# EAGLE design octanis_eps_v05 (EAGLE 7.2.0)
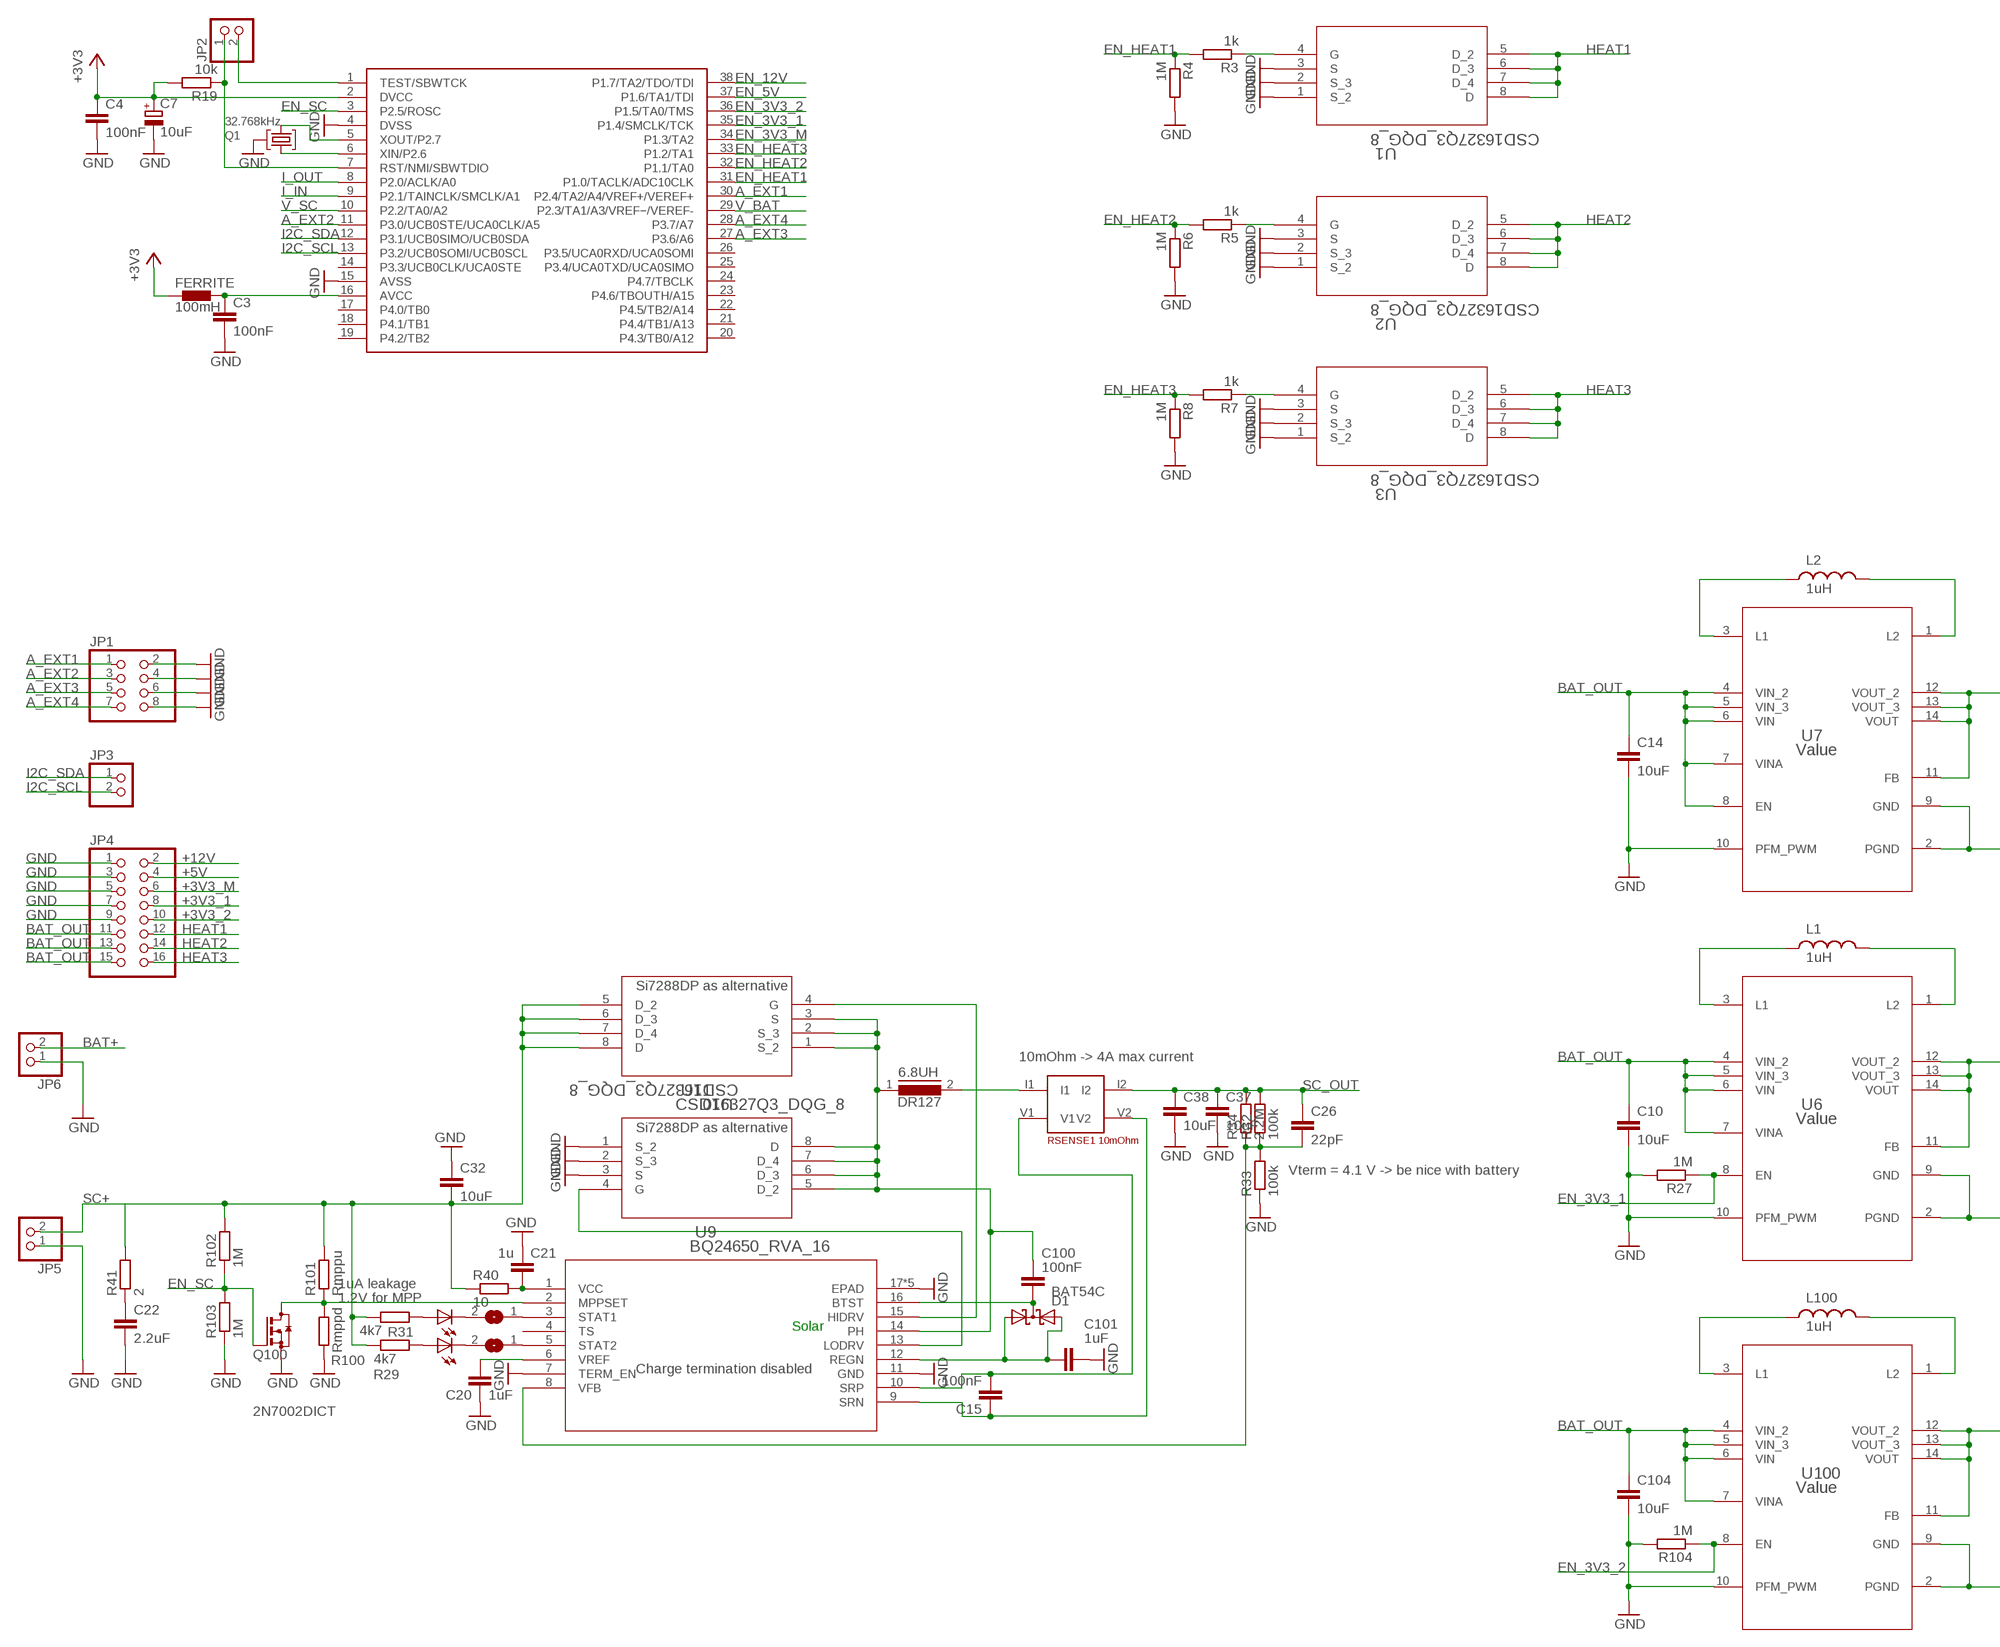
[diagram p0: schematic, sheet 1, part 1 of 2]
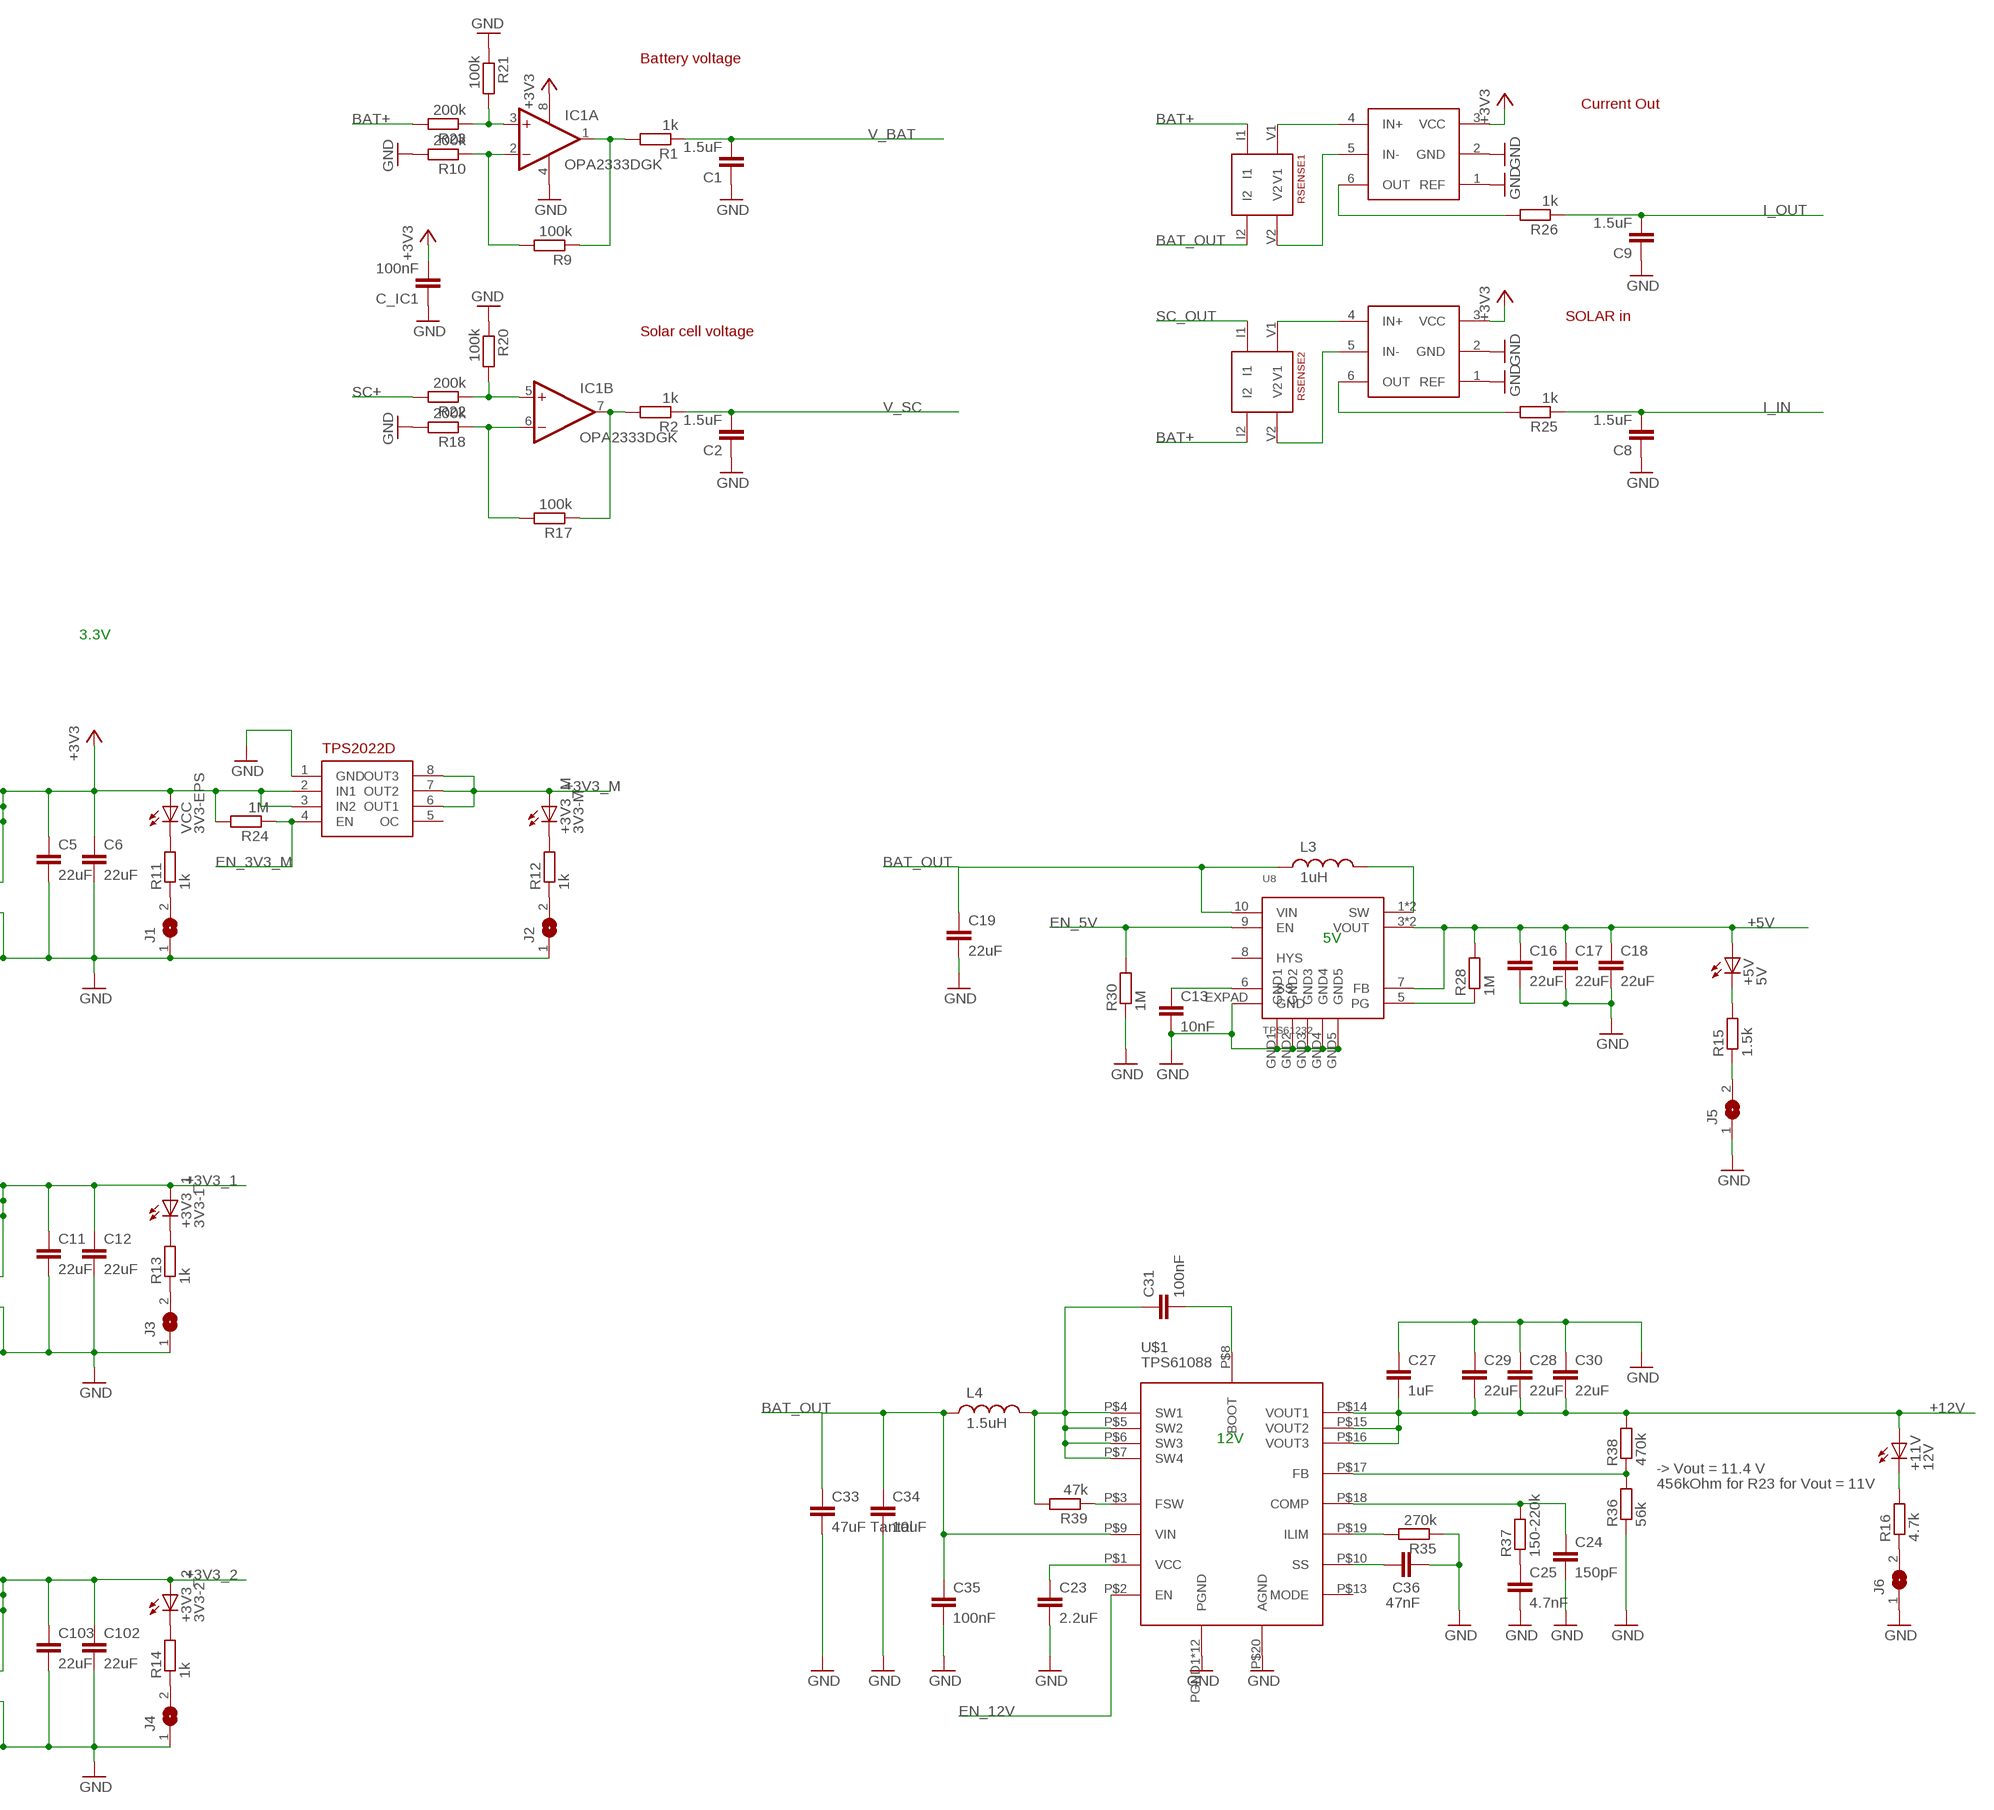
[diagram p1: schematic, sheet 1, part 2 of 2]

## Parts
6.8UH  DR127  [DR127]
+3V3_1  3V3-1  LEDCHIPLED_0603  [CHIPLED_0603]
+3V3_2  3V3-2  LEDCHIPLED_0603  [CHIPLED_0603]
+3V3_M  3V3-M  LEDCHIPLED_0603  [CHIPLED_0603]
+5V  5V  LEDCHIPLED_0603  [CHIPLED_0603]
+11V  12V  LEDCHIPLED_0603  [CHIPLED_0603]
C1  1.5uF  C-EUC0603  [C0603]
C2  1.5uF  C-EUC0603  [C0603]
C3  100nF  C-EUC0603  [C0603]
C4  100nF  C-EUC0603  [C0603]
C5  22uF  C-EUC0805  [C0805]
C6  22uF  C-EUC0805  [C0805]
C7  10uF  CPOL-EUA/3216-18R  [A/3216-18R]
C8  1.5uF  C-EUC0603  [C0603]
C9  1.5uF  C-EUC0603  [C0603]
C10  10uF  C-EUC0805  [C0805]
C11  22uF  C-EUC0805  [C0805]
C12  22uF  C-EUC0805  [C0805]
C13  10nF  C-EUC0603  [C0603]
C14  10uF  C-EUC0805  [C0805]
C15  100nF  C-EUC0603  [C0603]
C16  22uF  C-EUC0805  [C0805]
C17  22uF  C-EUC0805  [C0805]
C18  22uF  C-EUC0805  [C0805]
C19  22uF  C-EUC0603  [C0603]
C20  1uF  C-EUC0603  [C0603]
C21  1u  C-EUC0603  [C0603]
C22  2.2uF  C-EUC0603  [C0603]
C23  2.2uF  C-EUC0603  [C0603]
C24  150pF  C-EUC0603  [C0603]
C25  4.7nF  C-EUC0603  [C0603]
C26  22pF  C-EUC0603  [C0603]
C27  1uF  C-EUC0603  [C0603]
C28  22uF  C-EUC0805  [C0805]
C29  22uF  C-EUC0805  [C0805]
C30  22uF  C-EUC0805  [C0805]
C31  100nF  C-EUC0603  [C0603]
C32  10uF  C-EUC0805  [C0805]
C33  47uF Tantal  C-EUC1210  [C1210]
C34  10uF  C-EUC0805  [C0805]
C35  100nF  C-EUC0603  [C0603]
C36  47nF  C-EUC0603  [C0603]
C37  10uF  C-EUC0805  [C0805]
C38  10uF  C-EUC0805  [C0805]
C100  100nF  C-EUC0603  [C0603]
C101  1uF  C-EUC0603  [C0603]
C102  22uF  C-EUC0805  [C0805]
C103  22uF  C-EUC0805  [C0805]
C104  10uF  C-EUC0805  [C0805]
C_IC1  100nF  C-EUC0603  [C0603]
D1  BAT54C  [SOT23]
FERRITE  100mH  BLM15HD601SN1  [0402]
IC1  OPA2333DGK  [MSOP08]
J1  SJ  [SJ]
J2  SJ  [SJ]
J3  SJ  [SJ]
J4  SJ  [SJ]
J5  SJ  [SJ]
J6  SJ  [SJ]
J7  SJ  [SJ]
J8  SJ  [SJ]
JP1  PINHD-2X4  [2X04]
JP2  PINHD-1X2  [1X02]
JP3  PINHD-1X2  [1X02]
JP4  PINHD-2X8  [2X08]
JP5  PINHD-1X2  [1X02]
JP6  PINHD-1X2  [1X02]
L1  1uH  XFL4020  [XFL4020]
L2  1uH  XFL4020  [XFL4020]
L3  1uH  XFL4020  [XFL4020]
L4  1.5uH  XFL4020  [XFL4020]
L100  1uH  XFL4020  [XFL4020]
Q1  32.768kHz  MS3V-T1R  [MS3V-T1R]
Q100  BSS123  [SOT23]
R1  1k  R-EU_R0603  [R0603]
R2  1k  R-EU_R0603  [R0603]
R3  1k  R-EU_R0603  [R0603]
R4  1M  R-EU_R0603  [R0603]
R5  1k  R-EU_R0603  [R0603]
R6  1M  R-EU_R0603  [R0603]
R7  1k  R-EU_R0603  [R0603]
R8  1M  R-EU_R0603  [R0603]
R9  100k  R-EU_R0603  [R0603]
R10  200k  R-EU_R0603  [R0603]
R11  1k  R-EU_R0603  [R0603]
R12  1k  R-EU_R0603  [R0603]
R13  1k  R-EU_R0603  [R0603]
R14  1k  R-EU_R0603  [R0603]
R15  1.5k  R-EU_R0603  [R0603]
R16  4.7k  R-EU_R0603  [R0603]
R17  100k  R-EU_R0603  [R0603]
R18  200k  R-EU_R0603  [R0603]
R19  10k  R-EU_R0603  [R0603]
R20  100k  R-EU_R0603  [R0603]
R21  100k  R-EU_R0603  [R0603]
R22  200k  R-EU_R0603  [R0603]
R23  200k  R-EU_R0603  [R0603]
R24  1M  R-EU_R0603  [R0603]
R25  1k  R-EU_R0603  [R0603]
R26  1k  R-EU_R0603  [R0603]
R27  1M  R-EU_R0603  [R0603]
R28  1M  R-EU_R0603  [R0603]
R29  4k7  R-EU_R0603  [R0603]
R30  1M  R-EU_R0603  [R0603]
R31  4k7  R-EU_R0603  [R0603]
R32  100k  R-EU_R0603  [R0603]
R33  100k  R-EU_R0603  [R0603]
R34  2.2M  R-EU_R0603  [R0603]
R35  270k  R-EU_R0603  [R0603]
R36  56k  R-EU_R0603  [R0603]
R37  150-220k  R-EU_R0603  [R0603]
R38  470k  R-EU_R0603  [R0603]
R39  47k  R-EU_R0603  [R0603]
R40  10  R-EU_R1206  [R1206]
R41  2  R-EU_R2012  [R2012]
R100  Rmppd  R-EU_R0603  [R0603]
R101  Rmppu  R-EU_R0603  [R0603]
R102  1M  R-EU_R0603  [R0603]
R103  1M  R-EU_R0603  [R0603]
R104  1M  R-EU_R0603  [R0603]
R_SENSE1  RSENSE1 10mOhm  CURRENT_RESISTOR  [4PADS_RESISTOR]
R_SENSE2  RSENSE1  CURRENT_RESISTOR  [4PADS_RESISTOR]
RSENSE1  RSENSE2  CURRENT_RESISTOR  [4PADS_RESISTOR]
STAT1  5V-ok  LEDCHIPLED_0603  [CHIPLED_0603]
STAT2  5V-ok  LEDCHIPLED_0603  [CHIPLED_0603]
U1  CSD16327Q3_DQG_8  [DQG8]
U2  CSD16327Q3_DQG_8  [DQG8]
U3  CSD16327Q3_DQG_8  [DQG8]
U4  MSP430G2544  [TSSOP38]
U5  TPS2022D  [SO8]
U6  Value  TPS630250RNCR  [RNC0014A]
U7  Value  TPS630250RNCR  [RNC0014A]
U8  TPS61232  [S-PVSON-N10]
U9  BQ24650_RVA_16  [RVA16_2P14X2P14]
U10  CSD16327Q3_DQG_8  [DQG8]
U11  CSD16327Q3_DQG_8  [DQG8]
U100  Value  TPS630250RNCR  [RNC0014A]
U$1  TPS61088  [R-PVQFN-N20]
U$2  INA213  [SC70-6]
U$3  INA213  [SC70-6]
VCC  3V3-EPS  LEDCHIPLED_0603  [CHIPLED_0603]

## Nets
+3V3: C4.1 C5.1 C6.1 C7.+ C_IC1.2 FERRITE.1 IC1.8(P:V+) R19.2 R24.2 U4.2(DVCC) U5.2(IN1) U5.3(IN2) U7.11(FB) U7.12(VOUT_2) U7.13(VOUT_3) U7.14(VOUT) U$2.3(VCC) U$3.3(VCC) VCC.A
+3V3_1: +3V3_1.A C11.1 C12.1 JP4.8 U6.11(FB) U6.12(VOUT_2) U6.13(VOUT_3) U6.14(VOUT)
+3V3_2: +3V3_2.A C102.1 C103.1 JP4.10 U100.11(FB) U100.12(VOUT_2) U100.13(VOUT_3) U100.14(VOUT)
+3V3_M: +3V3_M.A JP4.6 U5.6(OUT1) U5.7(OUT2) U5.8(OUT3)
+5V [fine]: +5V.A C16.1 C17.1 C18.1 JP4.4 R28.2 U8.3(VOUT) U8.4(VOUT) U8.7(FB)
+12V [fine]: +11V.A C27.2 C28.2 C29.2 C30.2 JP4.2 R38.2 U$1.P$14(VOUT1) U$1.P$15(VOUT2) U$1.P$16(VOUT3)
A_EXT1: JP1.1 U4.30(P2.4/TA2/A4/VREF+/VEREF+)
A_EXT2: JP1.3 U4.11(P3.0/UCB0STE/UCA0CLK/A5)
A_EXT3: JP1.5 U4.27(P3.6/A6)
A_EXT4: JP1.7 U4.28(P3.7/A7)
BAT+: JP6.2 R23.2 R_SENSE2.I1 RSENSE1.I2
BAT_OUT: C10.1 C14.1 C19.1 C33.1 C34.1 C35.1 C104.1 JP4.11 JP4.13 JP4.15 L3.P$1 L4.P$1 R_SENSE2.I2 U6.4(VIN_2) U6.5(VIN_3) U6.6(VIN) U6.7(VINA) U7.4(VIN_2) U7.5(VIN_3) U7.6(VIN) U7.7(VINA) U7.8(EN) U8.10(VIN) U100.4(VIN_2) U100.5(VIN_3) U100.6(VIN) U100.7(VINA) U$1.P$9(VIN)
EN_3V3_1: R27.1 U4.35(P1.4/SMCLK/TCK) U6.8(EN)
EN_3V3_2: R104.1 U4.36(P1.5/TA0/TMS) U100.8(EN)
EN_3V3_M: R24.1 U4.34(P1.3/TA2) U5.4(EN)
EN_5V: R30.2 U4.37(P1.6/TA1/TDI) U8.9(EN)
EN_12V: U4.38(P1.7/TA2/TDO/TDI) U$1.P$2(EN)
EN_HEAT1: R3.2 R4.1 U4.31(P1.0/TACLK/ADC10CLK)
EN_HEAT2: R5.2 R6.1 U4.32(P1.1/TA0)
EN_HEAT3: R7.2 R8.1 U4.33(P1.2/TA1)
EN_SC: Q100.1(G) R102.1 R103.2 U4.3(P2.5/ROSC)
GND [power]: C1.1 C2.1 C3.2 C4.2 C5.2 C6.2 C7.- C8.1 C9.1 C10.2 C11.2 C12.2 C13.2 C14.2 C16.2 C17.2 C18.2 C19.2 C20.2 C21.2 C22.2 C23.2 C24.2 C25.2 C27.1 C28.1 C29.1 C30.1 C32.1 C33.2 C34.2 C35.2 C36.2 C37.2 C38.2 C101.2 C102.2 C103.2 C104.2 C_IC1.1 IC1.4(P:V-) J1.1 J2.1 J3.1 J4.1 J5.1 J6.1 JP1.2 JP1.4 JP1.6 JP1.8 JP4.1 JP4.3 JP4.5 JP4.7 JP4.9 JP5.1 JP6.1 Q1.P3(GND) Q100.2(S) R4.2 R6.2 R8.2 R10.2 R18.2 R20.1 R21.1 R27.2 R30.1 R33.1 R35.1 R36.1 R100.1 R103.1 R104.2 U1.1(S_2) U1.2(S_3) U1.3(S) U2.1(S_2) U2.2(S_3) U2.3(S) U3.1(S_2) U3.2(S_3) U3.3(S) U4.4(DVSS) U4.15(AVSS) U5.1(GND) U6.2(PGND) U6.9(GND) U6.10(PFM_PWM) U7.2(PGND) U7.9(GND) U7.10(PFM_PWM) U8.EXPAD(GND) U8.GND1 U8.GND2 U8.GND3 U8.GND4 U8.GND5 U9.7(TERM_EN) U9.11(GND) U9.17(EPAD) U9.V(EPAD) U9.V_1(EPAD) U9.V_2(EPAD) U9.V_3(EPAD) U11.1(S_2) U11.2(S_3) U11.3(S) U100.2(PGND) U100.9(GND) U100.10(PFM_PWM) U$1.P$20(AGND) U$1.PGND1(PGND) U$1.PGND2(PGND) U$1.PGND3(PGND) U$1.PGND4(PGND) U$1.PGND5(PGND) U$1.PGND6(PGND) U$1.PGND7(PGND) U$1.PGND8(PGND) U$1.PGND9(PGND) U$1.PGND10(PGND) U$1.PGND11(PGND) U$1.PGND12(PGND) U$2.1(REF) U$2.2(GND) U$3.1(REF) U$3.2(GND)
HEAT1: JP4.12 U1.5(D_2) U1.6(D_3) U1.7(D_4) U1.8(D)
HEAT2: JP4.14 U2.5(D_2) U2.6(D_3) U2.7(D_4) U2.8(D)
HEAT3: JP4.16 U3.5(D_2) U3.6(D_3) U3.7(D_4) U3.8(D)
I2C_SCL: JP3.2 U4.13(P3.2/UCB0SOMI/UCB0SCL)
I2C_SDA: JP3.1 U4.12(P3.1/UCB0SIMO/UCB0SDA)
I_IN: C8.2 R25.1 U4.9(P2.1/TAINCLK/SMCLK/A1)
I_OUT: C9.2 R26.1 U4.8(P2.0/ACLK/A0)
IND: L3.P$2 U8.1(SW) U8.2(SW)
LED5: +5V.C R15.2
N$1: L2.P$1 U7.3(L1)
N$2: R28.1 U8.5(PG)
N$3: L2.P$2 U7.1(L2)
N$4: 6.8UH.2 R_SENSE1.I1
N$5: C13.1 U8.6(SS)
N$6: L1.P$1 U6.3(L1)
N$7: L1.P$2 U6.1(L2)
N$11: L100.P$1 U100.3(L1)
N$12: L100.P$2 U100.1(L2)
N$14: J5.2 R15.1
N$19: IC1.1(A:OUT) R1.2 R9.1
N$20: IC1.2(A:-IN) R9.2 R10.1
N$21: IC1.3(A:+IN) R21.2 R23.1
N$22: IC1.7(B:OUT) R2.2 R17.1
N$23: IC1.6(B:-IN) R17.2 R18.1
N$24: IC1.5(B:+IN) R20.2 R22.1
N$25: R26.2 U$3.6(OUT)
N$26: R25.2 U$2.6(OUT)
N$27: R7.1 U3.4(G)
N$30: Q1.P1 U4.6(XIN/P2.6)
N$31: R5.1 U2.4(G)
N$32: R_SENSE2.V1 U$3.4(IN+)
N$33: R_SENSE2.V2 U$3.5(IN-)
N$34: RSENSE1.V1 U$2.4(IN+)
N$35: RSENSE1.V2 U$2.5(IN-)
N$36: Q1.P2 U4.5(XOUT/P2.7)
N$37: R3.1 U1.4(G)
N$38: C31.2 U$1.P$8(BOOT)
N$39: +3V3_M.C R12.2
N$40: J2.2 R12.1
N$43: R11.2 VCC.C
N$45: J1.2 R11.1
N$46: +3V3_2.C R14.2
N$47: J4.2 R14.1
N$48: +11V.C R16.2
N$49: J6.2 R16.1
N$50: C31.1 L4.P$2 R39.2 U$1.P$4(SW1) U$1.P$5(SW2) U$1.P$6(SW3) U$1.P$7(SW4)
N$51: +3V3_1.C R13.2
N$52: J3.2 R13.1
N$53: R39.1 U$1.P$3(FSW)
N$54: C25.1 R37.1
N$56: C36.1 U$1.P$10(SS)
N$57: R35.2 U$1.P$19(ILIM)
N$58: C24.1 R37.2 U$1.P$18(COMP)
N$59: C23.1 U$1.P$1(VCC)
N$60: R36.2 R38.1 U$1.P$17(FB)
N$64: Q100.3(D) R100.2 R101.1 U9.2(MPPSET)
N$65: C22.1 R41.1
N$66: R31.1 STAT1.A
N$67: J7.2 STAT2.C
N$68: J8.2 STAT1.C
N$69: R29.1 STAT2.A
N$70: J7.1 U9.5(STAT2)
N$71: J8.1 U9.3(STAT1)
N$72: C20.1 U9.6(VREF)
N$73: C21.1 R40.2 U9.1(VCC)
N$75: JP2.2 U4.1(TEST/SBWTCK)
N$76: 6.8UH.1 C100.1 U9.14(PH) U10.1(S_2) U10.2(S_3) U10.3(S) U11.5(D_2) U11.6(D_3) U11.7(D_4) U11.8(D)
N$77: C15.2 R_SENSE1.V1 U9.10(SRP)
N$78: C15.1 R_SENSE1.V2 U9.9(SRN)
N$80: U9.15(HIDRV) U10.4(G)
N$81: U9.13(LODRV) U11.4(G)
N$82: C26.2 R32.1 R33.2 R34.1 U9.8(VFB)
N$84: C101.1 D1.1(A1) D1.2(A2) U9.12(REGN)
N$85: C100.2 D1.3(CC) U9.16(BTST)
N$93: JP2.1 R19.1 U4.7(RST/NMI/SBWTDIO)
N$99: C3.1 FERRITE.2 U4.16(AVCC)
SC+: C32.2 JP5.2 R22.2 R29.2 R31.2 R40.1 R41.2 R101.2 R102.2 U10.5(D_2) U10.6(D_3) U10.7(D_4) U10.8(D)
SC_OUT: C26.1 C37.1 C38.1 R32.2 R34.2 R_SENSE1.I2 RSENSE1.I1
V_BAT: C1.2 R1.1 U4.29(P2.3/TA1/A3/VREF−/VEREF-)
V_SC: C2.2 R2.1 U4.10(P2.2/TA0/A2)
Unconnected: U4.14(P3.3/UCB0CLK/UCA0STE) U4.17(P4.0/TB0) U4.18(P4.1/TB1) U4.19(P4.2/TB2) U4.20(P4.3/TB0/A12) U4.21(P4.4/TB1/A13) U4.22(P4.5/TB2/A14) U4.23(P4.6/TBOUTH/A15) U4.24(P4.7/TBCLK) U4.25(P3.4/UCA0TXD/UCA0SIMO) U4.26(P3.5/UCA0RXD/UCA0SOMI) U5.5(OC) U8.8(HYS) U9.4(TS) U$1.P$13(MODE)

## Notes on the sheet
- Battery voltage
- Current Out
- SOLAR in
- Solar cell voltage
- 3.3V
- 5V
- Si7288DP as alternative
- 10mOhm -> 4A max current
- Si7288DP as alternative
- Vterm = 4.1 V -> be nice with battery
- 1uA leakage
- 1.2V for MPP | 12V
- Solar | -> Vout = 11.4 V
- 456kOhm for R23 for Vout = 11V
- Charge termination disabled
- 2N7002DICT

## Library data of the parts
6.8UH = inductors:DR127: High Power Density, High Efficiency, Shielded Inductors Source: coiltronics_dr_series.pdf
+3V3_1 +3V3_2 +3V3_M +5V +11V STAT1 STAT2 VCC = adafruit:LED: LED OSRAM: - CHIPLED LG R971, LG N971, LY N971, LG Q971, LY Q971, LO R971, LY R971 LH N974, LH R974 LS Q976, LO Q976, LY Q976 LO Q996 - Hyper CHIPLED LW Q18S LB Q993, LB Q99A, LB R99A - SideLED LS A670, LO A670, LY A670, LG A670, LP A670 LB A673, LV A673, LT A673, LW A673 LH A674 LY A675 LS A676, LA A676, LO A676, LY A676, LW A676 LS A679, LY A679, LG A679 - Hyper Micro SIDELED® LS Y876, LA Y876, LO Y876, LY Y876 LT Y87S - SmartLED LW L88C, LW L88S LB L89C, LB L89S, LG L890 LS L89K, LO L89K, LY L89K LS L896, LA L896, LO L896, LY L896 - TOPLED LS T670, LO T670, LY T670, LG T670, LP T670 LSG T670, LSP T670, LSY T670, LOP T670, LYG T670 LG T671, LOG T671, LSG T671 LB T673, LV T673, LT T673, LW T673 LH T674 LS T676, LA T676, LO T676, LY T676, LB T676, LH T676, LSB T676, LW T676 LB T67C, LV T67C, LT T67C, LS T67K, LO T67K, LY T67K, LW E67C LS E67B, LA E67B, LO E67B, LY E67B, LB E67C, LV E67C, LT E67C LW T67C LS T679, LY T679, LG T679 LS T770, LO T770, LY T770, LG T770, LP T770 LB T773, LV T773, LT T773, LW T773 LH T774 LS E675, LA E675, LY E675, LS T675 LS T776, LA T776, LO T776, LY T776, LB T776 LHGB T686 LT T68C, LB T68C - Hyper Mini TOPLED® LB M676 - Mini TOPLED Santana® LG M470 LS M47K, LO M47K, LY M47K Source: http://www.osram.convergy.de/
C1-C4 C8 C9 C13 C15 C19-C27 C31 C33 C35 C36 C100 C101 C_IC1 = rcl:C-EU: CAPACITOR, European symbol
C5 C6 C10-C12 C14 C16-C18 C28-C30 C32 C34 C37 C38 C102-C104 = resistor:C-EU: CAPACITOR, European symbol
C7 = rcl:CPOL-EU: POLARIZED CAPACITOR, European symbol
D1 = diode:BAT54C: Schottky Diodes Source: Fairchild .. BAT54.pdf
FERRITE = inductors:BLM15H: EMIFIL (R) Chip Ferrite Bead for GHz Noise Source: http://www.murata.com/ Ferrite Bead BLM15H.pdf
IC1 = linear:OPA2333: DUAL 1.8V, microPOWER CMOS OPERATIONAL AMPLIFIERS Zerø-Drift Series Source: Texas Instruments (Burr-Brown) .. U11 opa333 Operational Amp.pdf
J1-J8 = jumper:SJ: SMD solder JUMPER
JP1 = Headerlibrary:PINHD-2X4: PIN HEADER
JP2 JP3 JP5 JP6 = Headerlibrary:PINHD-1X2: PIN HEADER
JP4 = Headerlibrary:PINHD-2X8: PIN HEADER
L1-L4 L100 = Coilcraft:XFL4020
Q1 = microcrystal:MS3V-T1R
Q100 = transistor-small-signal:BSS123: N-CHANNEL MOS FET
R1-R23 R25 R26 R28-R34 R40 R41 R100-R103 = rcl:R-EU_: RESISTOR, European symbol
R24 R27 R35-R39 R104 = resistor:R-EU_: RESISTOR, European symbol
R_SENSE1 R_SENSE2 RSENSE1 = Octanis1_EPS:CURRENT_RESISTOR
U1-U3 U10 U11 = texasinstruments:CSD16327Q3_DQG_8; DATASHEETURL: http://www.ti.com/lit/gpn/CSD16327Q3; DESCRIPTION: N-Channel NexFET Power MOSFET; FAMILY_NAME: N-Channel MOSFET Transistors; GENERIC_PART_NUMBER: CSD16327Q3; INDUSTRY_STD_PKG_TYPE: SON; MANUFACTURER: Texas Instruments; PACKAGE_DESIGNATOR: DQG; PIN_COUNT: 8
U4 = Octanis1_EPS:MSP430G2544: MSP430G2x44 Mixed-Signal Microcontrollers
U5 = Octanis1_EPS:TPS2022D: TEXAS INSTRUMENTS - TPS2022D - IC, 1.5A PWR DIST SWITCH 8SOIC
U6 U7 U100 = octanis_eps_v05:TPS630250RNCR; ALTERNATEPARTNUMBER: TPS630250RNCT; COMPTYPE: IC; MANUFACTURER: Texas Instruments; MOUNTTYPE: SMT; PACKAGEREFERENCE: RNC0014A; PARTNUMBER: TPS630250RNCR; PIN_COUNT: 14; REFDES: RefDes; TYPE: TYPE
U8 = texasinstruments:TPS61232: Up to 96% Efficiency Synchronous Boost Converter 3.3 V to 5 V Power Conversion with 2.1 A Output Current Input Supply Voltage Supervisor with Adjustable Threshold/ Hysteresis Power Save Mode for Light Load Efficiency Load Disconnect During Shutdown Output Over Voltage Protection Programmable Soft Start Power Good Output Input Voltage Range: 2.3 V to 5.5 V Output Voltage Range: 2.5 V to 5.5 V 2 MHz Switching Frequency Output Capacitor Discharge (TPS61231) 3 mm × 3 mm × 0.9 mm SON Package
U9 = octanis_eps_v05:BQ24650_RVA_16; DATASHEETURL: http://www.ti.com/lit/gpn/BQ24650; DESCRIPTION: High Efficiency Synchronous Switch-Mode Charger Controller ? Solar Battery Charger; FAMILY_NAME: BATTERY CHARGE MANAGEMENT; GENERIC_PART_NUMBER: BQ24650; INDUSTRY_STD_PKG_TYPE: VQFN; MANUFACTURER: Texas Instruments; PACKAGE_DESIGNATOR: RVA; PIN_COUNT: 16
U$1 = texasinstruments:TPS61088
U$2 U$3 = Octanis1_EPS:INA213: Voltage Output, High or Low Side Measurement, Bi-Directional Zer ø -Drift Series Current-Shunt Monitor

## Net classes
0 default: clearance 0.152 mm
1 power: width 0.203 mm, drill 0.305 mm, clearance 0.152 mm
3 fine: width 0.406 mm, drill 0.61 mm, clearance 0.152 mm

## Board
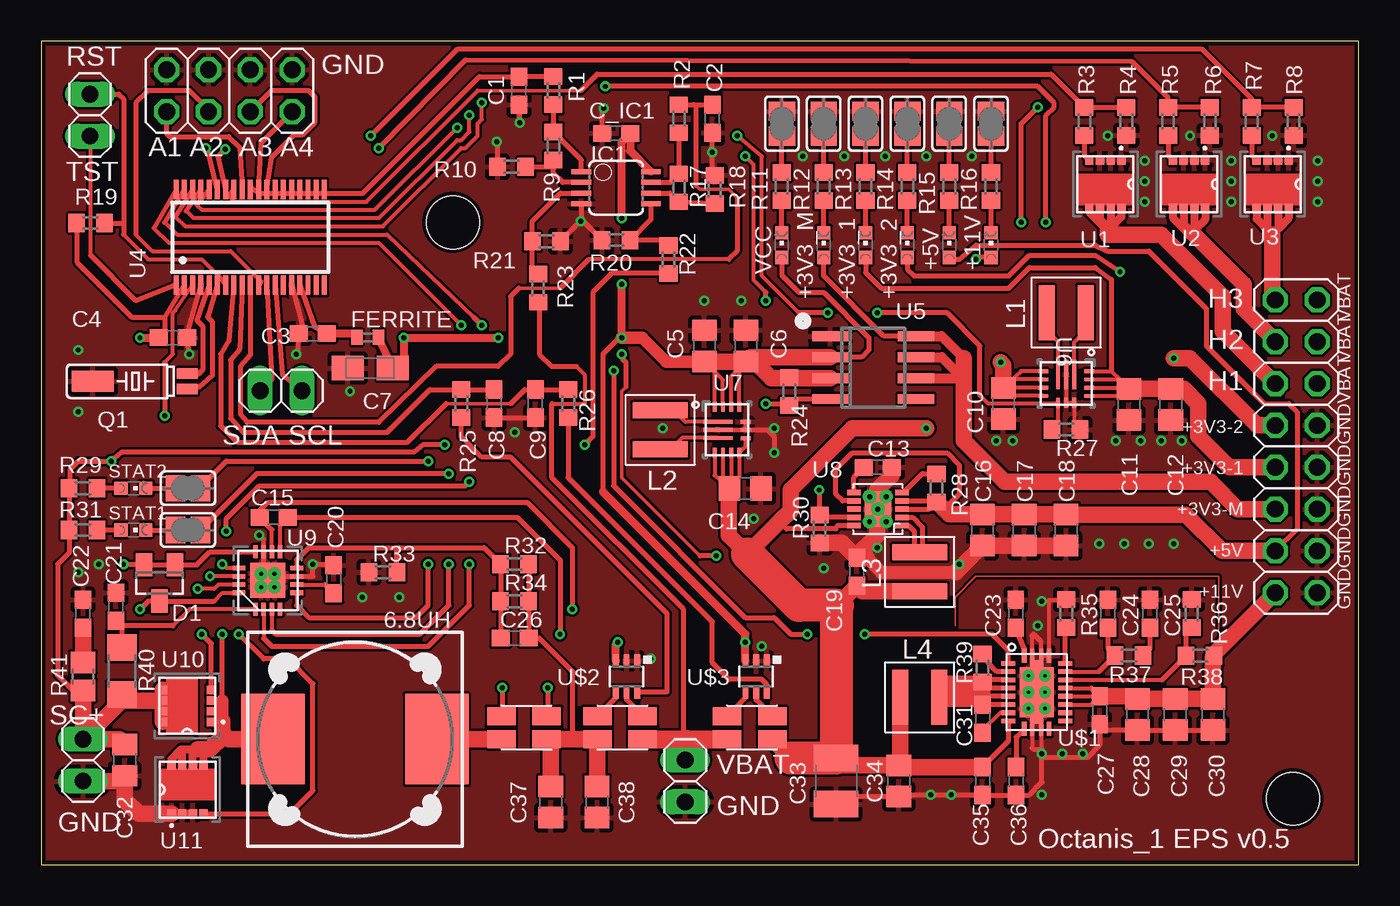
[diagram p2: board, top side]
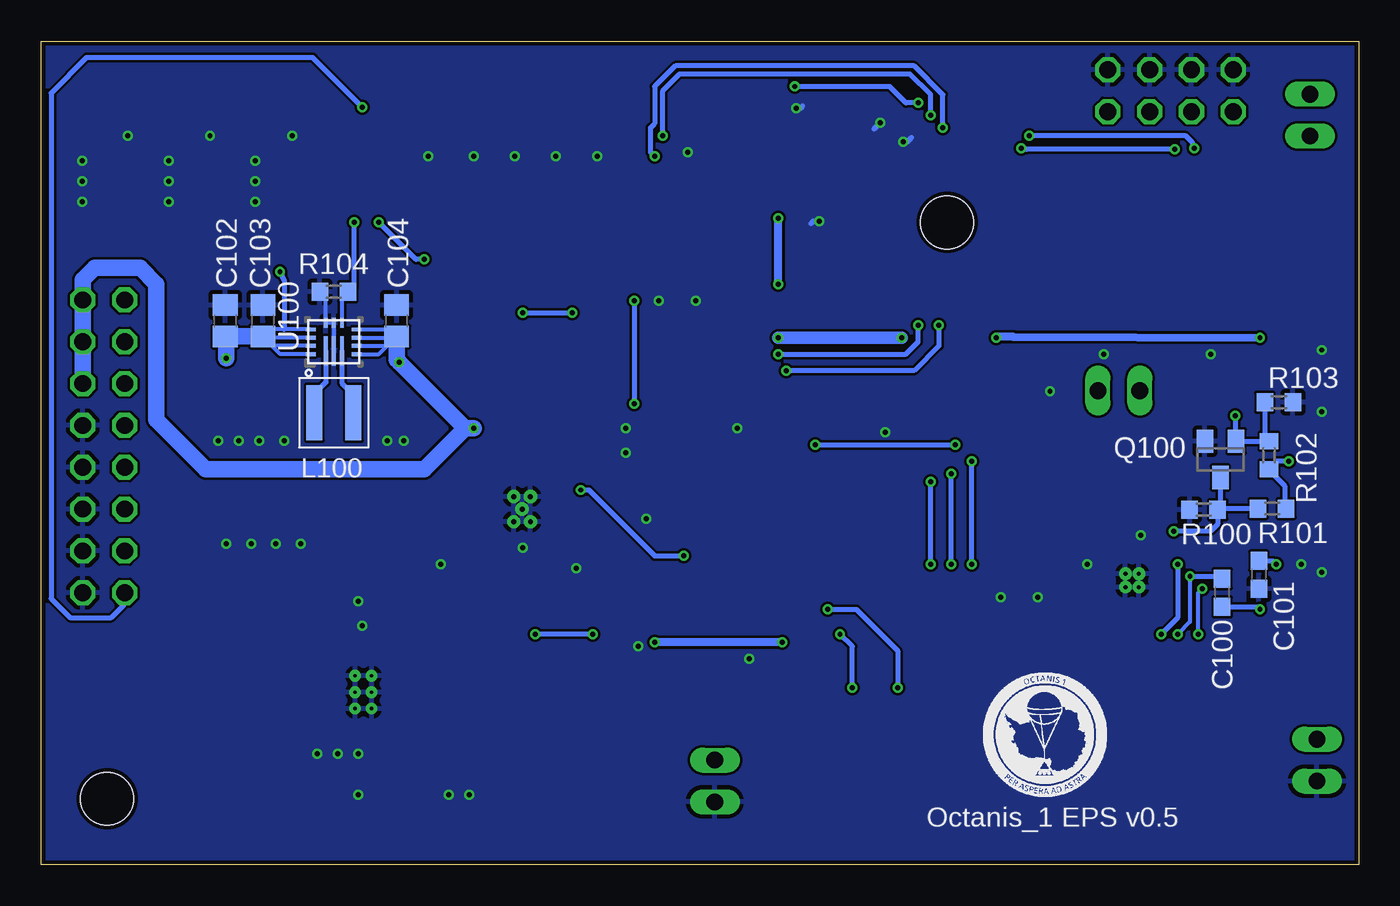
[diagram p3: board, bottom side, seen from below]

Size 80 x 50 mm. Coordinates in mm from the lower left corner, seen from the top.
Outline: 0,0 80,0 80,50 0,50 0,0
Copper layers (1*16): Top 0.035mm / dielectric 1.5mm / Bottom 0.035mm
Design rules "SeeedStudio_2layer_DRU_no_angle_20140221 *": minimum track width 6mil, minimum drill 0.3mm, track to track 6mil, track to pad 6mil, pad to pad 6mil, via to via 6mil, smd to smd 0mil, copper to edge 10mil, drill to drill 10mil, minimum pad ring 10mil, minimum via ring 6mil, stop-mask expansion 2mil, vias tented up to drill 100mil, thermal gap 10mil
Holes 3.2 mm at 25,39 76,4

### Footprints (pad centres in the part's own frame; a part is rotated, then mirrored left to right if it is on the bottom)
DR127 = smd 3.85 x 5.5: 1 -4.975,0; 2 4.975,0
CHIPLED_0603 = smd 0.8 x 0.8: A 0,-0.75; C 0,0.75
C0603 = smd 1.1 x 1: 1 -0.85,0; 2 0.85,0
C0805 = smd 1.3 x 1.5: 1 -0.95,0; 2 0.95,0
A/3216-18R = smd 1.95 x 1.5: + 1.375,0; - -1.375,0
C1210 = smd 1.6 x 2.7: 1 -1.4,0; 2 1.4,0
SOT23 = smd 1 x 1.4: 1 -0.95,-1.1; 2 0.95,-1.1; 3 0,1.1
0402 = smd 0.7 x 0.9: 1 -0.65,0; 2 0.65,0
MSOP08 = smd 0.3 x 1.2: 1 -0.976,-2.113; 2 -0.326,-2.113; 3 0.324,-2.113; 4 0.974,-2.113; 5 0.974,2.112; 6 0.324,2.112; 7 -0.326,2.112; 8 -0.976,2.112
SJ = smd 1.168 x 1.6: 1 -0.762,0; 2 0.762,0
2X04 = drill 1.016 octagon: 1 -3.81,-1.27; 2 -3.81,1.27; 3 -1.27,-1.27; 4 -1.27,1.27; 5 1.27,-1.27; 6 1.27,1.27; 7 3.81,-1.27; 8 3.81,1.27
1X02 = drill 1.016 long: 1 -1.27,0; 2 1.27,0
2X08 = drill 1.016 octagon: 1 -8.89,-1.27; 2 -8.89,1.27; 3 -6.35,-1.27; 4 -6.35,1.27; 5 -3.81,-1.27; 6 -3.81,1.27; 7 -1.27,-1.27; 8 -1.27,1.27; 9 1.27,-1.27; 10 1.27,1.27; 11 3.81,-1.27; 12 3.81,1.27; 13 6.35,-1.27; 14 6.35,1.27; 15 8.89,-1.27; 16 8.89,1.27
XFL4020 = smd 0.965 x 3.353: P$1 -1.181,0; P$2 1.181,0
MS3V-T1R = smd 0.635 x 1.27: P1 -0.47,-4.43; P2 0.47,-4.43 | smd 1.27 x 2.54: P3 0,1.3
R0603 = smd 1 x 1.1: 1 -0.85,0; 2 0.85,0
R1206 = smd 1.6 x 1.803: 1 -1.422,0; 2 1.422,0
R2012 = smd 1.3 x 1.5: 1 -0.85,0; 2 0.85,0
4PADS_RESISTOR = smd 1.727 x 1.1: I1 0,0; I2 2.751,0; V1 0,1.4; V2 2.751,1.4
DQG8 = smd 0.559 x 0.508: 1 -1.47,0.975; 2 -1.47,0.325; 3 -1.47,-0.325; 4 -1.47,-0.975; 5 1.47,-0.975; 6 1.47,-0.325; 7 1.47,0.325; 8 1.47,0.975
TSSOP38 = smd 0.3 x 1.2: 1 -4.5,-2.9; 2 -4,-2.9; 3 -3.5,-2.9; 4 -3,-2.9; 5 -2.5,-2.9; 6 -2,-2.9; 7 -1.5,-2.9; 8 -1,-2.9; 9 -0.5,-2.9; 10 0,-2.9; 11 0.5,-2.9; 12 1,-2.9; 13 1.5,-2.9; 14 2,-2.9; 15 2.5,-2.9; 16 3,-2.9; 17 3.5,-2.9; 18 4,-2.9; 19 4.5,-2.9; 20 4.5,2.9; 21 4,2.9; 22 3.5,2.9; 23 3,2.9; 24 2.5,2.9; 25 2,2.9; 26 1.5,2.9; 27 1,2.9; 28 0.5,2.9; 29 0,2.9; 30 -0.5,2.9; 31 -1,2.9; 32 -1.5,2.9; 33 -2,2.9; 34 -2.5,2.9; 35 -3,2.9; 36 -3.5,2.9; 37 -4,2.9; 38 -4.5,2.9
SO8 = smd 0.6 x 2.2: 1 -1.905,-2.6; 2 -0.635,-2.6; 3 0.635,-2.6; 4 1.905,-2.6; 5 1.905,2.6; 6 0.635,2.6; 7 -0.635,2.6; 8 -1.905,2.6
RNC0014A = smd 1.778 x 0.229: 1 -0.555,0.49; 2 -0.555,0; 3 -0.555,-0.49 | smd 0.229 x 0.61: 4 -0.75,-1.4; 5 -0.25,-1.4; 6 0.25,-1.4; 7 0.75,-1.4; 11 0.75,1.4; 12 0.25,1.4; 13 -0.25,1.4; 14 -0.75,1.4 | smd 0.61 x 0.229: 8 1.15,-0.5; 9 1.15,0; 10 1.15,0.5
S-PVSON-N10 = smd 0.28 x 0.825: 1 -1,-1.462; 2 -0.5,-1.462; 3 0,-1.462; 4 0.5,-1.462; 5 1,-1.462; 6 1,1.462; 7 0.5,1.462; 8 0,1.462; 9 -0.5,1.462; 10 -1,1.462 | smd 2.15 x 1.6: EXPAD 0,0 | drill 0.3 pad 0.605: GND1 -0.762,0.508 | drill 0.3 pad 0.61: GND2 -0.762,-0.508; GND3 0,0; GND4 0.762,-0.508 | drill 0.305 pad 0.605: GND5 0.762,0.508
RVA16_2P14X2P14 = smd 0.787 x 0.279: 1 -1.75,0.75; 2 -1.75,0.25; 3 -1.75,-0.25; 4 -1.75,-0.75; 9 1.75,-0.75; 10 1.75,-0.25; 11 1.75,0.25; 12 1.75,0.75 | smd 0.279 x 0.787: 5 -0.75,-1.75; 6 -0.25,-1.75; 7 0.25,-1.75; 8 0.75,-1.75; 13 0.75,1.75; 14 0.25,1.75; 15 -0.25,1.75; 16 -0.75,1.75 | smd 2.134 x 2.134: 17 0,0 | drill 0.254: V -0.406,-0.406; V_1 -0.406,0.406; V_2 0.406,-0.406; V_3 0.406,0.406
R-PVQFN-N20 = smd 0.85 x 0.28: P$1 0,0; P$10 4.45,0; P$11 4.45,1.5; P$20 0,1.5 | smd 0.28 x 0.85: P$2 0.475,-0.975; P$3 0.975,-0.975; P$4 1.475,-0.975; P$5 1.975,-0.975; P$6 2.475,-0.975; P$7 2.975,-0.975; P$8 3.475,-0.975; P$9 3.975,-0.975; P$12 3.975,2.475; P$13 3.475,2.475; P$14 2.975,2.475; P$15 2.475,2.475; P$16 1.975,2.475; P$17 1.475,2.475; P$18 0.975,2.475; P$19 0.475,2.475 | smd 3.05 x 2.05: PGND1 2.225,0.75 | smd 1.15 x 0.23: PGND2 0.15,1.025; PGND3 0.15,0.475; PGND4 4.3,0.475; PGND5 4.3,1.025 | smd 3.85 x 0.78: PGND6 2.225,0.75 | drill 0.2 pad 0.4: PGND7 2.225,0.25; PGND8 1.225,0.25; PGND9 1.225,1.25; PGND10 2.225,1.25; PGND11 3.225,0.25; PGND12 3.225,1.25
SC70-6 = smd 0.35 x 0.8: 1 -0.65,-0.95; 2 0,-0.95; 3 0.65,-0.95; 4 0.65,0.95; 5 0,0.95; 6 -0.65,0.95

### Placement (x,y rotation side)
6.8UH  19.05,7.62 0 top
+3V3_1  50.05,37.62 0 top
+3V3_2  52.59,37.62 0 top
+3V3_M  47.51,37.62 0 top
+5V  55.13,37.62 0 top
+11V  57.67,37.62 0 top
C1  29,47 90 top
C2  40.75,45.29 90 top
C3  16.5,32.25 180 top
C4  8,32 0 top
C5  40.27,31.5 90 top
C6  42.79,31.5 90 top
C7  19.98,30.15 0 top
C8  27.5,28 90 top
C9  30,28 90 top
C10  58.42,28 270 top
C11  66.04,27.94 270 top
C12  68.58,27.94 270 top
C13  50.8,24.13 0 top
C14  42.75,22.84 0 top
C15  14.11,21.09 180 top
C16  57.15,20.32 270 top
C17  59.69,20.32 270 top
C18  62.23,20.32 270 top
C19  49.53,17.78 90 top
C20  17.76,17.34 90 top
C21  4.53,15.65 90 top
C22  2.54,15.24 90 top
C23  59.17,15.24 90 top
C24  64.77,15.24 90 top
C25  67.31,15.24 90 top
C26  28.75,13.75 180 top
C27  64.27,9.37 90 top
C28  66.56,9.12 90 top
C29  68.85,9.12 90 top
C30  71.14,9.12 90 top
C31  57.15,8.87 270 top
C32  5.08,6.35 90 top
C33  48.26,5.08 270 top
C34  52.07,5.08 270 top
C35  57.15,5.08 270 top
C36  59.19,5.08 270 top
C37  30.94,3.81 270 top
C38  33.75,3.81 270 top
C100  8.3,16.51 270 bottom
C101  6.07,17.6 270 bottom
C102  68.83,33.02 90 bottom
C103  66.54,33.02 90 bottom
C104  58.42,33.02 90 bottom
C_IC1  34.91,44.4 0 top
D1  7.18,17.11 180 top
FERRITE  19.82,32.02 180 top
IC1  34.91,41.1 270 top
J1  44.97,44.99 270 top
J2  47.51,44.99 270 top
J3  50.05,44.99 270 top
J4  52.59,44.99 270 top
J5  55.13,44.99 270 top
J6  57.67,44.99 270 top
J7  8.91,22.86 180 top
J8  8.91,20.32 180 top
JP1  11.43,46.99 0 top
JP2  2.96,45.51 270 top
JP3  14.57,28.78 0 top
JP4  76.2,25.4 90 top
JP5  2.54,6.35 90 top
JP6  39.1,5.08 90 top
L1  62.23,33.52 0 top
L2  37.58,26.4 90 top
L3  53.34,17.78 90 top
L4  53.34,10.16 0 top
L100  62.23,27.44 180 bottom
Q1  4.44,29.35 90 top
Q100  8.4,24.61 180 bottom
R1  31.1,47 270 top
R2  38.72,45.29 270 top
R3  63.34,45.13 90 top
R4  65.88,45.13 270 top
R5  68.42,45.13 90 top
R6  70.96,45.13 270 top
R7  73.5,45.13 90 top
R8  76.04,45.13 270 top
R9  31.1,43.64 270 top
R10  28.56,42.37 180 top
R11  44.97,41.18 270 top
R12  47.51,41.18 270 top
R13  50.05,41.18 270 top
R14  52.59,41.18 270 top
R15  55.13,41.18 270 top
R16  57.67,41.18 270 top
R17  38.72,41.1 270 top
R18  40.89,41 90 top
R19  3,38.96 180 top
R20  34.91,37.92 0 top
R21  30.67,37.85 180 top
R22  38.08,36.75 270 top
R23  30.17,35 270 top
R24  45.42,28.72 90 top
R25  25.5,28 270 top
R26  32,28 270 top
R27  62.23,26.42 0 top
R28  54.36,22.88 270 top
R29  2.54,22.86 180 top
R30  47.26,20.39 90 top
R31  2.54,20.32 180 top
R32  28.75,18.25 0 top
R33  20.75,17.75 0 top
R34  28.75,16 0 top
R35  62.23,15.24 270 top
R36  69.85,15.24 270 top
R37  66.04,12.7 180 top
R38  70.37,12.68 0 top
R39  57.15,11.95 270 top
R40  4.91,11.76 90 top
R41  2.54,11.43 270 top
R100  9.42,21.55 0 bottom
R101  5.26,21.62 0 bottom
R102  5.45,24.86 270 bottom
R103  4.85,28.08 180 bottom
R104  62.23,34.79 180 bottom
R_SENSE1  27.94,7.62 0 top
R_SENSE2  41.64,7.62 0 top
RSENSE1  33.77,7.62 0 top
STAT1  5.6,20.32 270 top
STAT2  5.6,22.86 270 top
U1  64.61,41.32 270 top
U2  69.69,41.32 270 top
U3  74.77,41.32 270 top
U4  12.7,38.1 0 top
U5  50.52,30.18 270 top
U6  62.23,29.21 270 top
U7  41.64,26.4 0 top
U8  50.8,21.59 90 top
U9  13.76,17.26 90 top
U10  8.86,9.64 180 top
U11  8.89,4.56 90 top
U100  62.23,31.75 90 bottom
U$1  59.69,12.7 270 top
U$2  35.54,11.43 180 top
U$3  43.41,11.43 180 top
VCC  44.97,37.62 0 top

### Tracks (layer width: path | path; a pad name or v marks a point on that pad's centre or on a via)
+3V3  (via drill 0.3)
  Top 0.25: U7.14 40.89,29.93 C5.1 41.39,29.43 U7.13 | U7.12 41.89,29.65 C6.1 42.39,30.15 U7.11
  Top 0.3: U4.2 7.5,33.25 | 7.5,33.25 7.5,32.39 C4.1 | R19.2 2.16,36.59 5.5,33.25 7.5,33.25 | FERRITE.1 20.43,32.02 | 22,30.8 C7.+ | U5.3 45.45,29.55 R24.2 | VCC.A 44.97,35.78 46,34.75 47.5,34.75 50.25,32 50.25,31.25 49.81,30.82 U5.2 | v42.76,13.49 v42.75,13.5 | v35.25,32 35.1,32 34.1,31 34.1,22.65
  Top 0.5: IC1.8 35.76,43.34 C_IC1.2 35.25,43.89 v35.25,39.25 | 20.43,32.02 C7.+ | v6,32 C4.1 | 22,30.8 v22,32 v27.75,32 | U$2.3 34.89,13.39 v35,13.5 | U$3.3 v42.76,13.49 | v42.75,13.5 42.75,14 34.1,22.65 | v35.25,32 v35.25,35.25
  Top 0.75: v35.25,32 36.5,32 37.95,30.55 C5.1
  Top 1: C5.1 C6.1 43.05,30.82 | 43.05,30.82 U5.2 | 43.05,30.82 44.33,29.55 U5.3
  Bottom 0.3: 21.95,32.05 v22,32
  Bottom 0.5: v6,32 20.95,32.05 21.95,32.05 | v35,13.5 v42.75,13.5 | v35.25,35.25 v35.25,39.25
  Bottom 0.75: v27.75,32 v35.25,32
+3V3_1
  Top 0.25: U6.14 64.97,29.96 65.47,29.46 | 65.47,29.46 C11.1 | U6.13 65.47,29.46 | U6.12 65.97,28.96 C11.1 | U6.11 65.61,28.46 C11.1
  Top 0.3: 64.97,29.96 64.97,35.53 64,36.25 60,36.25 58.75,35 51,35 50.05,35.95 +3V3_1.A
  Top 1: C11.1 C12.1 69.36,28.89 70.25,28 70.25,26 72.12,24.13 JP4.8
+3V3_2  (via drill 0.3)
  Top 0.3: +3V3_2.A 52.59,36.16 53,35.75 58.75,35.75 60,37 64,37 v65.5,36
  Top 1: v68.75,30.75 69.75,30.75 73.83,26.67 JP4.10
  Bottom 0.25: U100.14 65.47,31 C103.1 | U100.13 65.97,31.5 C103.1 | U100.12 65.97,32 C103.1 | U100.11 65.25,32.5 66.11,32.5 C103.1
  Bottom 0.3: 65.25,32.5 65.25,35.5 v65.5,36
  Bottom 1: C103.1 C102.1 68.75,32.07 v68.75,30.75
+3V3_M
  Top 0.3: U5.8 51.16,32.09 47.5,35.75 47.5,36.61 +3V3_M.A
  Top 0.6: U5.8 54.66,32.09 56,30.75 | U5.7 54.69,30.82 55.88,29.62 | 55.88,29.62 56,29.5 | U5.6 55.8,29.55 55.88,29.62
  Top 1: 56,30.75 56,29.5 56,25.75 58.5,23.25 71,23.25 72.66,21.59 JP4.6
+5V
  Top 0.3: U8.4 54.3,22.09 R28.2 53.92,21.59 U8.3 | U8.7 48.66,22.09 48.25,22.5 48.25,24 49.25,25 55,25 55.75,24.25 55.75,22.5 54.82,21.57 | +5V.A 55.25,36.75 55.75,36.75 56.75,37.62 64,37.62 64.75,37.25 67.25,37.25 70.75,33.75 70.75,31.5 74.25,28 75.75,28 76.25,27.5 76.25,20.37 JP4.4
  Top 1: JP4.4 71.7,19.05 69.5,21.25 62.25,21.25 C18.1 C17.1 C16.1 55.12,21.27 54.82,21.57 R28.2
+12V  (via drill 0.3)
  Top 0.25: U$1.P$16 63.77,10.72 | U$1.P$14 63.77,9.72 | U$1.P$15 C27.2
  Top 0.3: 63.77,10.72 C27.2 | 63.77,9.72 C27.2 | C27.2 | v59.5,39 59.5,45 v60.5,46 | +11V.A 56.87,36.87 v56.75,36.75
  Top 1: C27.2 66.41,10.22 C28.2 C29.2 C30.2 71.14,12.6 R38.2 71.22,12.8 JP4.2
  Bottom 0.3: v60.5,46 63.5,49 77.25,49 79.4,46.85 79.4,16.15 78.25,15 75.75,15 75,15.75 75,16.44 JP4.2 | v56.75,36.75 57.25,36.75 v59.5,39
A_EXT1
  Top 0.3: JP1.1 7.6,45.7 7.6,44.4 7.8,44.2 11.4,44.2 12.05,43.55 U4.30
A_EXT2
  Top 0.25: 5.75,38.25 6.75,37.25 11.5,37.25 13.35,35.4
  Top 0.3: JP1.3 10.16,45.84 9,47 6.5,47 5.75,46.25 5.75,38.25 | 13.35,35.4 U4.11
A_EXT3
  Top 0.3: JP1.5 13.97,46.99 16.26,46.99 16.64,46.61 16.64,45.09 15.88,44.32 15.37,44.32 14,42.96 U4.27
A_EXT4
  Top 0.3: U4.28 13.35,43.83 JP1.7
BAT+
  Top 0.25: 31,28 33,28 33,29.75 32.5,30.25
  Top 0.3: RSENSE1.I2 38.87,7.62 39,7.75 39,15.5 31,23.5 31,28 | R23.2 30.25,34.13 30.25,31 31,30.25 32.5,30.25
  Top 1: JP6.2 39.1,7.47 39.25,7.62
  Top 1.1: RSENSE1.I2 39.25,7.62 R_SENSE2.I1
BAT_OUT  (via drill 0.3)
  Top 0.25: U6.4 59.49,29.96 C10.1 | U6.5 58.99,29.46 C10.1 | U6.6 58.49,28.96 C10.1 | U6.7 58.85,28.46 C10.1 | C14.1 42.39,23.54 U7.7 42.79,25.4 U7.8 | U7.6 41.89,23.04 C14.1 | U7.5 41.39,23.14 C14.1 | U7.4 40.89,23.64 C14.1
  Top 0.3: U8.10 48.34,20.59 48.25,20.39 45.25,20.39 44.88,20.88 | U$1.P$9 58.72,7.5 C35.1
  Top 1: R_SENSE2.I2 45.53,6.48 | C33.1 48.71,6.03 C34.1 52.16,6.12 | 52.16,6.12 L4.P$1 | C19.1 48.26,15.66 | C19.1 48.35,15.75 | C14.1 41.75,22.79 41.75,20 42.88,18.88 44.88,20.88 45.5,21.5 45.5,22.75 49.25,26.5 v53.75,26.5 | C10.1 58.42,30.33 v58.25,30.5 | L3.P$1 49.86,16.6 C19.1 | 52.16,6.12 52.35,5.93 C35.1
  Top 2: 45.53,6.48 C33.1 48.26,15.66 | 48.35,15.75 46,15.75 42.88,18.88
  Bottom 0.25: U100.7 58.85,32.5 C104.1 | U100.4 59.49,31 C104.1 | U100.5 58.99,31.5 C104.1 | U100.6 58.49,32 C104.1
  Bottom 1: C104.1 58.42,30.67 v58.25,30.5 54.25,26.5 | 54.25,26.5 v53.75,26.5 | 54.25,26.5 56.75,24 70,24 73,27 73,35.25 74,36.25 76.75,36.25 77.47,35.53 JP4.15 JP4.13 JP4.11
EN_3V3_1  (via drill 0.3)
  Top 0.25: 8.8,39.7 9.25,39.25 20.5,39.25 25.25,44 25.5,44 26,44.5 v26,45.5 | U6.8 61.73,26.77 R27.1 | 61.67,28 57.5,28 57,28.5 | 46,33.5 43.75,35.75 43.75,43 v42.25,44.25
  Top 0.3: U4.35 8.8,39.7 | U6.8 61.67,28 | 57,28.5 57,31.5 55,33.5 v50.75,33.5 | v47.75,33.5 46,33.5
  Bottom 0.3: v50.75,33.5 v47.75,33.5 | v26,45.5 26,46.75 27.25,48 41.25,48 42.25,47 v42.25,44.25
EN_3V3_2  (via drill 0.3)
  Top 0.25: 8.15,39.35 8.75,38.75 20.75,38.75 25.5,43.5 25.75,43.5 26.5,44.25 26.5,45 26.75,45.25 v26.75,46.25
  Top 0.3: U4.36 8.15,39.35 | v34.25,47.25 60.5,47.25 61.5,46.25 61.5,46 61,45.5 v61,39
  Bottom 0.25: U100.8 61.73,34.44 R104.1
  Bottom 0.3: R104.1 61.38,34.87 61,35 v61,39 | v34.25,47.25 28.5,47.25 27.5,46.25 v26.75,46.25
EN_3V3_M  (via drill 0.3)
  Top 0.25: 9.45,40.05 9.75,39.75 20.25,39.75 v25.25,44.75 | 44,34.75 43.25,35.5 43.25,42.5 v42.75,43
  Top 0.3: U5.4 45.83,28.27 R24.1 45.29,28 v44,28 | U4.34 9.45,40.05 | v44,34.25 44,34.75
  Bottom 0.3: v44,34.25 v44,28 | v25.25,44.75 25.25,46.75 27,48.5 41.5,48.5 42.75,47.25 42.75,45 43,44.75 43,43.25 v42.75,43
EN_5V  (via drill 0.3)
  Top 0.2: 40,18.75 35.25,23.5 35.25,28.75 35.5,29
  Top 0.25: 7.5,39 8.25,38.25 21,38.25 26.25,33.25
  Top 0.3: U4.37 7.5,39 | U8.9 47.41,21.09 R30.2 v47.25,22.75 | v41,18.75 40,18.75 | 26.25,33.25 v26.75,32.75 | v35.25,31 35.25,30.75 35.5,30.5 35.5,29
  Bottom 0.3: v47.25,22.75 46.75,22.75 42.75,18.75 v41,18.75 | v35.25,31 27.5,31 26.75,31.75 v26.75,32.75
EN_12V  (via drill 0.3)
  Top 0.25: 6.85,38.65 7.75,37.75 20.5,37.75 v25.5,32.75
  Top 0.3: U4.38 6.85,38.65 | U$1.P$2 58.72,13.04 57.75,14 v50,14 | v34.75,30 34.75,23 42.75,15 44.5,15 45.5,14 v46.5,14
  Bottom 0.3: v25.5,32.75 25.5,31.5 27,30 v34.75,30 | v46.5,14 v50,14
EN_HEAT1
  Top 0.2: 26.5,47 32.75,47
  Top 0.25: 11.4,40.6 11.75,40.25 19.75,40.25 26.5,47
  Top 0.3: U4.31 11.4,40.6 | R4.1 R3.2 61.32,48 33.75,48 32.75,47
EN_HEAT2  (via drill 0.3)
  Top 0.3: U4.32 10.75,43.01 v11.18,43.43 | R6.1 R5.2 68.42,46.58 66.25,48.75 25.75,48.85 v20.5,43.5
  Bottom 0.3: v11.18,43.43 20.18,43.43 v20.5,43.5
EN_HEAT3  (via drill 0.3)
  Top 0.3: R8.1 R7.2 73.5,46.5 70.5,49.5 25.25,49.5 v20,44.25 | U4.33 10.1,43.4 v10,43.5
  Bottom 0.3: v20,44.25 10.5,44.25 10.1,43.85 10.1,43.6 v10,43.5
EN_SC  (via drill 0.3)
  Top 0.25: 7.5,30.5 8,31 8,33.5 8.15,33.65 U4.3
  Top 0.3: 7.5,30.5 v7.5,27.25
  Bottom 0.3: v7.5,27.25 7.5,25.76 Q100.1 R102.1 5.7,25.96 R103.2
GND  (via drill 0.3)
  Top 0.25: U6.2 U6.9 U6.10 62.73,26.77 R27.2 | U7.2 U7.9 U7.10 | U9.11 13.51,19.74 | U$1.PGND4 60.16,7.08 | U$1.PGND5 60.72,7.04 | 60.87,12.7 U$1.P$20 61.19,16.05 | U$1.PGND3 60.16,13.91 | U$1.PGND2 60.72,13.54
  Top 0.3: C_IC1.1 34.06,45.84 v34.15,45.93 | IC1.4 32.8,39.11 v32.75,39.07 | R10.2 27.71,43.85 v27.67,43.89 | C1.1 v29.07,45.04 | U4.4 8.8,32.13 C4.2 8.95,31.05 v9,31 | U4.15 15.95,32.42 C3.2 15.54,31.04 v15.5,31 | C8.1 C9.1 | R21.1 v32.74,39.07 v32.75,39.07 | R20.1 32.92,39.07 v32.75,39.07 | R18.2 40.75,42.08 C2.1 | 13.51,19.74 v13.25,20 | U7.9 44.1,26.4 44.5,26 v44.5,25 | 60.16,7.08 60.25,7 60.68,7 60.72,7.04 60.75,7 v60.75,6.75 60.75,6.5 | U$1.PGND5 60.72,9.25 U$1.PGND12 U$1.PGND11 U$1.PGND7 U$1.PGND6 U$1.PGND10 61,10.54 61,11.5 60.98,11.47 U$1.PGND9 | U$1.PGND8 U$1.PGND9 | 60.72,11.7 U$1.PGND9 | 61.19,16.05 R35.1 | 60.75,6.5 60.75,5 59.98,4.23 C36.2 C35.2 52.17,4.23 C34.2 48.71,4.13 C33.2 | 60.75,6.5 63.5,6.5 64.27,7.27 C27.1 64.62,8.17 C28.1 C29.1 C30.1 | C20.2 17.7,18.25 16.75,18.25 16.5,18 16.5,17.5 16.49,17.51 U9.7 14.01,17.51 U9.17 | U9.V_3 13.5,17.81 13.5,19.5 | 60.16,13.91 60.25,14 60.72,13.54
  Top 0.5: U11.1 U11.2 U11.3 | U8.GND4 U8.GND5 50.29,22.1 U8.GND3 | U8.GND2 51.31,21.08 U8.GND3 | U8.GND1 50.29,21.08 U8.GND3
  Top 0.8: 50.12,18.63 51,17.75 55.53,17.75
  Top 1: JP5.1 4.76,5.08 C32.1 5.08,3.92 5.91,3.09 U11.1 | C19.2 50.12,18.63 | 55.53,17.75 C16.2 C17.2 C18.2 | C19.2 49.53,18.78 50.75,20 50.75,21.54 U8.GND3 50.75,21.64 50.75,22.75 51.65,23.65 C13.2 | R30.1 48.62,19.54 C19.2
  Bottom 0.25: R104.2 62.73,34.44 U100.10 U100.9 U100.2
  Bottom 0.3: v34.15,45.93 33.89,45.93 33.77,46.05 | v32.75,39.07 33.13,39.07 33.26,38.94 | v27.67,43.89 27.42,43.89 27.16,44.15 | v29.07,45.04 29.45,44.66
  other vias: 18.75,28.75 28.75,26.25 2.25,27.5 2.25,31.25 3.5,18.25 2.25,17.75 43.25,21 47.5,18 50.75,19.25 37,12.5 43.75,13.25 56.5,43 53.75,43 51.25,43 48.75,43 46.25,43 40.75,43.25 37.75,26.5 40.25,34.25 42.5,34.25 44.5,26.5 77.5,42.75 77.5,41.5 77.5,40.25 72.25,40.25 72.25,41.5 72.25,42.75 69.75,44.25 74.75,44.25 64.75,44.25 67,42.75 67,41.5 67,40.25 69.25,25.75 68,25.75 66.75,25.75 65.25,25.75 59,25.75 58,25.75 19.5,16.25 21.75,16.25 16.5,18.25 54,4.25 55.25,4.25 60.75,4.25 62,6.75 63.25,6.75 60.5,14.5 60.75,16 55.75,18.25 64.25,19.5 65.75,19.5 67.25,19.5 68.75,19.5
  pour Bottom: 0,50 80,50 80,0 0,0
  pour Top: 0,0 0,50 80,50 80,0
HEAT1
  Top 0.5: U1.5 63.63,39.62 64.75,38.5 64.88,38.62 | U1.8 65.58,39.34 64.88,38.62 | U1.6 64.28,39.22 64.75,38.75 | 64.75,38.75 64.88,38.62 | U1.7 64.94,38.94 64.75,38.75
  Top 1: 64.75,38.5 64.75,38.25 68,38.25 71.75,34.5 71.75,32.39 JP4.12
HEAT2
  Top 0.5: U2.5 68.72,39.28 69.75,38.25 69.88,38.38 | U2.8 70.67,39.16 70.02,38.52 | U2.7 70.02,38.52 | 70.02,38.52 69.88,38.38 | U2.6 69.36,38.88 69.88,38.38
  Top 1: JP4.14 74.93,31.82 73,33.75 73,35.25 69.88,38.38
HEAT3
  Top 0.5: U3.5 73.8,39.2 74.44,38.55 | U3.6 74.44,38.55 | 74.44,38.55 74.75,38.25 75.12,38.62 | U3.8 75.75,39.24 75.12,38.62 | U3.7 75.09,38.66 75.12,38.62
  Top 1: 74.75,38.25 74.75,34.47 JP4.16
I2C_SCL
  Top 0.3: U4.13 14.65,29.77 JP3.2
I2C_SDA
  Top 0.3: U4.12 14,29.48 JP3.1
I_IN
  Top 0.3: U4.9 12.05,31.3 11.5,30.65 11.5,27.1 12.25,26.25 21,26.25 23.6,28.85 R25.1 C8.2
I_OUT
  Top 0.2: 24.59,28 28.5,28
  Top 0.3: U4.8 11.4,31.8 10.9,31 10.9,26.65 11.9,25.65 22.23,25.65 24.59,28 | 28.5,28 29.35,28.85 C9.2 R26.1
IND
  Top 0.3: U8.1 52.66,20.59 53,20.25 53,19.3 L3.P$2 53.5,19.12 53.5,20.5 52.91,21.09 U8.2
LED5
  Top 0.3: +5V.C R15.2
N$1
  Top 0.25: U7.3 38.91,25.91 38.25,25.25 37.11,25.25 L2.P$1
N$2
  Top 0.3: U8.5 52.34,22.59 53.5,23.75 54.34,23.75 R28.1
N$3
  Top 0.25: U7.1 39.11,26.89 38.25,27.75 37.25,27.75 L2.P$2
N$4
  Top 1: 6.8UH.2 R_SENSE1.I1
N$5
  Top 0.3: U8.6 49.34,23.52 C13.1
N$6
  Top 0.25: U6.3 61.74,31.76 61,32.5 61,33.47 L1.P$1
N$7
  Top 0.25: U6.1 62.72,31.72 63.5,32.5 63.5,33.43 L1.P$2
N$8
  Top 0.1: 71.5,14.25 71.5,17.5 56.75,17.5 55.5,16.25 55.5,14.5
N$11
  Bottom 0.3: U100.3 61.74,29.24 61.25,28.75 61.25,27.64 L100.P$1
N$12
  Bottom 0.3: U100.1 62.72,29.28 63.5,28.5 63.5,27.53 L100.P$2
N$14
  Top 0.3: R15.1 J5.2
N$19
  Top 0.3: IC1.1 32.8,42.79 R9.1 R1.2
N$20
  Top 0.3: IC1.2 31.66,41.43 31.1,41.99 31.1,42.24 | 31.1,42.24 R9.2 | R10.1 30.97,42.37 31.1,42.24
N$21
  Top 0.3: R23.1 29.82,36.26 R21.2 29.82,39.07 31.53,40.78 IC1.3
N$22
  Top 0.3: IC1.7 38.2,41.43 R17.1 R2.2
N$23
  Top 0.3: IC1.6 38.19,40.78 R17.2 R18.1
N$24
  Top 0.3: IC1.5 37.02,39.19 R20.2 37.92,37.92 R22.1
N$25
  Top 0.3: R26.2 32,23.5 40.75,14.75 40.75,12.25 41.75,11.25 43.75,11.25 44.08,10.92 44.08,10.5 U$3.6
N$26
  Top 0.3: U$2.6 36.21,10.5 38,10.5 38,15.25 28.5,24.75 26.75,24.75 25.5,26 R25.2
N$27
  Top 0.3: R7.1 73.5,43.09 U3.4
N$30
  Top 0.3: U4.6 10.1,33.25 10.4,32.95 10.4,29.7 9.6,29 8.99,29 Q1.P1
N$31
  Top 0.3: R5.1 68.42,43.09 U2.4
N$32
  Top 0.3: U$3.4 42.76,10.14 R_SENSE2.V1
N$33
  Top 0.3: U$3.5 43.41,10 R_SENSE2.V2
N$34
  Top 0.3: U$2.4 34.89,10.14 RSENSE1.V1
N$35
  Top 0.3: U$2.5 35.54,10 RSENSE1.V2
N$36
  Top 0.3: U4.5 9.45,33.05 9.8,32.7 9.8,30.05 9.5,29.75 8.94,29.75 Q1.P2
N$37
  Top 0.3: R3.1 63.34,43.09 U1.4
N$38
  Top 0.25: U$1.P$8 58.23,9.22 57.15,8.15
  Top 0.3: 57.15,8.15 C31.2
N$39
  Top 0.3: +3V3_M.C R12.2
N$40
  Top 0.3: R12.1 J2.2
N$43
  Top 0.3: VCC.C R11.2
N$45
  Top 0.3: R11.1 J1.2
N$46
  Top 0.3: +3V3_2.C R14.2
N$47
  Top 0.3: R14.1 J4.2
N$48
  Top 0.3: +11V.C R16.2
N$49
  Top 0.3: R16.1 J6.2
N$50
  Top 0.3: U$1.P$4 54.75,11.22 54.75,11.25 54.52,11.25 54.52,11 L4.P$2 | U$1.P$5 54.52,10.72 L4.P$2 | U$1.P$6 54.52,10.22 L4.P$2 | U$1.P$7 54.52,9.72 L4.P$2
  Top 1: L4.P$2 57.15,10.16 C31.1 R39.2 | 57.15,11 54.52,11
N$51
  Top 0.3: +3V3_1.C R13.2
N$52
  Top 0.3: R13.1 J3.2
N$53
  Top 0.3: U$1.P$3 58.02,11.72 57.5,12.25 57.5,12.45 R39.1
N$54
  Top 0.3: C25.1 67.31,13.12 R37.1
N$56
  Top 0.3: U$1.P$10 59.19,7.75 C36.1
N$57
  Top 0.3: U$1.P$19 62.16,14.32 R35.2
N$58
  Top 0.25: U$1.P$18 64.22,11.72
  Top 0.3: 64.22,11.72 R37.2 64.77,13.12 C24.1
N$59
  Top 0.3: U$1.P$1 59.69,13.12 C23.1
N$60
  Top 0.25: U$1.P$17 68.06,11.22
  Top 0.3: 68.06,11.22 R38.1 69.52,14.06 R36.2
N$64  (via drill 0.3)
  Top 0.25: U9.2 13.51,13.74
  Top 0.3: 13.51,13.74 14,13.25 23.5,13.25 26,15.75 v26,18.25 | v11.25,20.25 11.25,21 13.25,23 25.75,23 v26,23.25
  Bottom 0.3: R101.1 8.5,21.62 R100.2 | Q100.3 8.4,21.72 R100.2 | R100.2 8.57,20.68 9,20.25 v11.25,20.25 | v26,18.25 v26,23.25
N$65
  Top 1: R41.1 C22.1
N$66
  Top 0.3: STAT1.A R31.1
N$67
  Top 0.3: STAT2.C J7.2
N$68
  Top 0.3: STAT1.C J8.2
N$69
  Top 0.3: STAT2.A R29.1
N$70  (via drill 0.3)
  Top 0.25: U9.5 15.51,15.74
  Top 0.3: 15.51,15.74 16.25,15 22.75,15 23.5,15.75 v23.5,18.25 | J7.1 9.67,22.92 11.25,24.5 v23.5,24.5
  Bottom 0.3: v23.5,18.25 v23.5,24.5
N$71  (via drill 0.3)
  Top 0.25: U9.3 14.01,14.24
  Top 0.3: 14.01,14.24 14.25,14 23,14 24.75,15.75 v24.75,18.25 | v24.75,23.75 13.1,23.75 J8.1
  Bottom 0.3: v24.75,18.25 v24.75,23.75
N$72
  Top 0.25: U9.6 17.24,17.01
  Top 0.3: 17.24,17.01 C20.1
N$73
  Top 0.25: U9.1 9.01,15.51 8,14.5
  Top 0.3: R40.2 4.91,14.42 | 4.91,14.42 C21.1 | 8,14.5 4.99,14.5 4.91,14.42
N$75
  Top 0.25: 3,37 3,44.2
  Top 0.3: U4.1 5.75,34.25 3,37 | 3,44.2 JP2.2
N$76  (via drill 0.3)
  Top 0.25: U9.14 v10.26,17.51
  Top 0.3: U10.3 10.71,9.96 11,10.25 v11,14 | v10.26,17.51 v10.25,17.5
  Top 0.5: U11.8 7.92,6.42 8.38,6.88 | 8.38,6.88 8.5,7 9.5,7 | U11.7 8.56,6.68 8.38,6.88 | U11.6 9.21,6.71 9.5,7 | U11.5 9.87,6.63 9.5,7 | U10.2 11,9.31 | U10.3 11,9.96 | U10.1 11,8.66
  Top 0.75: 11,8.75 11,9.31 11,9.96 | 11,8.66 11,8.5
  Top 1: 9.5,7 10.25,7 11,7.75 11,8 | 11,8 11,8.5 11,8.75 | 6.8UH.1 11.38,7.62 11,8
  Bottom 0.25: v10.25,17.5 10.25,14.75 v11,14
  Bottom 0.3: v10.25,17.5 8.44,17.5 C100.1
N$77  (via drill 0.3)
  Top 0.25: U9.10 14.01,20.34
  Top 0.3: 14.01,20.34 C15.2 13.26,21.51 13.75,22 29.5,22 32.25,19.25 v32.25,15.5 | v28,10.75 28,9.08 R_SENSE1.V1
  Bottom 0.3: v32.25,15.5 30.5,15.5 28,13 v28,10.75
N$78  (via drill 0.3)
  Top 0.25: U9.9 14.51,20.64
  Top 0.3: 14.51,20.64 C15.1 28.91,21.09 31.5,18.5 v31.5,14 | v30.75,10.75 30.75,9.08 R_SENSE1.V2
  Bottom 0.3: v30.75,10.75 30.75,13.25 v31.5,14
N$80  (via drill 0.3)
  Top 0.25: U9.15 10.76,17.01 10.5,16.75 v9.5,16.75
  Top 0.3: U10.4 10.33,13.42 v9.75,14
  Bottom 0.25: v9.75,14 9.75,16.5 v9.5,16.75
N$81  (via drill 0.3)
  Top 0.25: U9.13 11.24,18.01 v11,18.25
  Top 0.3: U11.4 15.09,3.09 16.5,4.5 16.5,11 15,12.5 13.5,12.5 v12,14
  Bottom 0.3: v11,18.25 11,15 v12,14
N$82
  Top 0.25: U9.8 15.51,18.51
  Top 0.3: 15.51,18.51 16.25,19.25 21.75,19.25 | 21.75,19.25 26.9,19.25 R32.1 R34.1 C26.2 | R33.2 21.6,19.1 21.75,19.25
N$84  (via drill 0.3)
  Top 0.3: U9.12 10.25,19 9.46,18.21 D1.1 D1.2 5.04,18.21 v5,18.25
  Bottom 0.3: C101.1 5.2,18.45 v5,18.25
N$85  (via drill 0.3)
  Top 0.25: 10.51,16.01 11,16.5 U9.16
  Top 0.3: 10.51,16.01 D1.3 6.51,16.01 v6,15.5 | U9.16
  Bottom 0.3: C100.2 6.16,15.66 v6,15.5
N$93
  Top 0.25: 5,38.25 6.5,36.75 9.75,36.75 10.75,35.75
  Top 0.3: JP2.1 4.72,46.78 5,46.5 5,39 | 5,39 5,38.25 | 10.75,35.75 U4.7 | R19.1 4.96,38.96 5,39
N$99
  Top 0.3: U4.16 16.6,32.64 C3.1 | 18.94,32.25 FERRITE.2
  Top 0.5: C3.1 18.94,32.25
SC+  (via drill 0.3)
  Top 0.3: R41.2 2.46,10.5 2,10.5 1,11.5 1,18.25 1.69,18.94 R31.2 R29.2 1.75,22.92 1.75,24 2.25,24.5 v4.25,24.5 4.9,25.05 22.65,25.05 23.2,25.5 v24.5,25.5 | R40.1 4.91,9.99 4.88,9.96 JP5.2 | R22.2 34.65,35.9 33.5,34.75 33.5,26 v33,25.5
  Top 1: JP5.2 4.76,7.62 C32.2 | JP5.2 R41.2 | U10.5 U10.6 | U10.6 U10.7 U10.8 | U10.6 4.88,9.96 JP5.2
  Bottom 0.3: R101.2 4.5,21.71 4.5,23 5.45,23.95 R102.2 4.96,24.5 v4.25,24.5 | v33,25.5 v24.5,25.5
SC_OUT
  Top 0.3: R32.2 R34.2 C26.1 30.25,13.75 32.25,11.75 32.25,7.87 32.5,7.62
  Top 1: C37.1 30.94,7.37 R_SENSE1.I2 32.5,7.62 RSENSE1.I1 33.75,7.6 C38.1
V_BAT
  Top 0.3: U4.29 12.7,41.15 13.22,40.76 19.51,40.76 26.6,47.85 C1.2 R1.1
V_SC
  Top 0.2: 39.75,41.25 40,41 41.75,41 42.25,40.5 | 31.5,35 29,35
  Top 0.25: 41.75,36.75 33.25,36.75
  Top 0.3: C2.2 R2.1 39.61,46.14 arc-90 39.75,46 39.75,41.25 | U4.10 12.7,30.95 12.1,30.25 12.1,27.35 12.5,26.85 20.5,26.85 24,30.25 27.75,30.25 28.5,31 28.5,34.5 29,35 | 42.25,40.5 42.25,37.25 41.75,36.75 | 33.25,36.75 31.5,35

### Text on the board
tNames: RST | GND | A1 | A2 | A3 | A4 | TST | H3 | VBAT | L1 | H2 | H1 | VBAT | VBAT | +3V3-2 | SDA | SCL | GND | +3V3-1 | L2 | GND | +3V3-M | +5V | GND | GND | L3 | +11V | GND | L4 | SC+ | VBAT | GND | GND | Octanis_1 EPS v0.5
bNames: L100 | Octanis_1 EPS v0.5